# Altium schematic sheet Adafruit STEMMA Speaker.SchDoc: Adafruit STEMMA Speaker
size 282 x 211 mm; Origin: Eagle; SheetNumber: 1; COMPANY: COMPANY; DRAWN: DRAWN; Date: 2019/10/3 15:38:12; REV: REV; GateName_1: G$1; SymbolName_1: FRAME_A4; LibraryName: microbuilder; DeviceSetName: FRAME_A4; GateName_2: G$3; SymbolName_2: FRAME_DOCFIELD; DRG: DRG; o: o; N: N; YEAR: >YEAR; C: C; ISSUE: ISSUE; FILE: FILE:; PAGE: PAGE:; CHECKED: CHECKED; DRGNO: >DRGNO
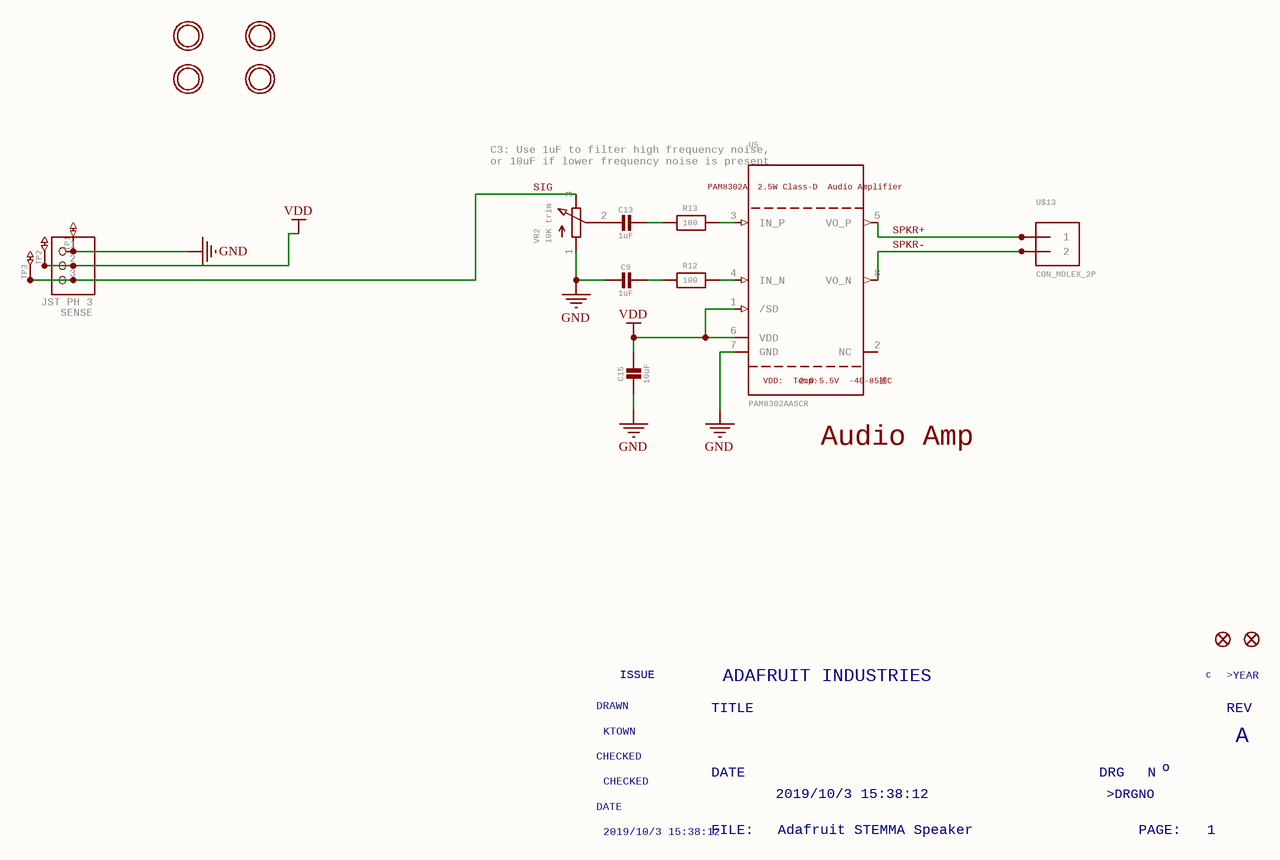
[diagram p0: Adafruit STEMMA Speaker.SchDoc]

## Parts
C9  1uF  [0603-NO]
C13  1uF  [0603-NO]
C15  10uF  [0805-NO]
FID1  FIDUCIAL_1MM  [FIDUCIAL_1MM]  (value not drawn)
FID2  FIDUCIAL_1MM  [FIDUCIAL_1MM]  (value not drawn)
R12  100  [0603-NO]
R13  100  [0603-NO]
SENSE  JST PH 3  [JSTPH3]
TP1  SEWTAPPCB_ALLIGATOR  [PCB_ALLI]  (value not drawn)
TP2  SEWTAPPCB_ALLIGATOR  [PCB_ALLI]  (value not drawn)
TP3  SEWTAPPCB_ALLIGATOR  [PCB_ALLI]  (value not drawn)
U5  PAM8302AASCR  PAM8302A
2.5WClass-D
AudioAmplifier: PAM8302A / 2.5W Class-D / Audio Amplifier  VDD:
Temp: VDD: / Temp:  2.0-5.5V
-40-85掳C: 2.0-5.5V / -40-85掳C  [MSOP8_0.65MM]
U$9  MOUNTINGHOLE2.0  [MOUNTINGHOLE_2.0_PLATED]  (value not drawn)
U$10  MOUNTINGHOLE2.0  [MOUNTINGHOLE_2.0_PLATED]  (value not drawn)
U$11  MOUNTINGHOLE2.0  [MOUNTINGHOLE_2.0_PLATED]  (value not drawn)
U$12  MOUNTINGHOLE2.0  [MOUNTINGHOLE_2.0_PLATED]  (value not drawn)
U$13  CON_MOLEX_2P  [53398-0271]
VR2  10K trim  [TRIMPOT_BOURNS_3303W]

## Nets
GND: C9.2 C15.2 SENSE.1 TP1.P$1(SEW) U5.7(GND) VR2.1(A)
VDD: C15.1 SENSE.2 TP2.P$1(SEW) U5.1(/SD) U5.6(VDD)
SIG: SENSE.3 TP3.P$1(SEW) VR2.3(E)
SPKR+: U5.5(VO_P) U$13.1
SPKR-: U5.8(VO_N) U$13.2
NetC9_1: C9.1 R12.1
NetC13_1: C13.1 R13.1
NetC13_2: C13.2 VR2.2(S)
NetR12_2: R12.2 U5.4(IN_N)
NetR13_2: R13.2 U5.3(IN_P)

Not connected (* = marked no-connect by the designer): U5 2(NC)

## Notes on the sheet
- C3: Use 1uF to filter high frequency noise,
  or 10uF if lower frequency noise is present
- Audio Amp
- DRAWN
- KTOWN
- ISSUE
- TITLE
- ADAFRUIT INDUSTRIES
- C
- REV
- >YEAR
- CHECKED
- DATE
- 2019/10/3 15:38:12
- DRG
- >DRGNO
- N
- o
- A
- FILE:
- Adafruit STEMMA Speaker
- PAGE:
- 1

## Library data of the parts
C9 C13 = CAP_CERAMIC0603_NO: Ceramic Capacitors   For new designs, use the packages preceded by an '_' character since they are more reliable:   The following footprints should be used on most boards: _0402 - Standard footprint for regular board layouts  _0603 - Standard footprint for regular board layouts  _0805 - Standard footprint for regular board layouts  _1206 - Standard footprint for regular board layouts       For extremely tight-pitch boards where space is at a premium, the following 'micro-pitch' footprints can be used (smaller pads, no silkscreen outline, etc.): _0402MP - Micro-pitch footprint for very dense/compact boards  _0603MP - Micro-pitch footprint for very dense/compact boards  _0805MP - Micro-pitch footprint for very dense/compact boards  _1206MP - Micro-pitch footprint for very dense/compact boards; GateName_1: G$1; SymbolName_1: CAPACITOR; DeviceName: 0603_NO; LibraryName: microbuilder; DeviceSetName: CAP_CERAMIC
C15 = CAP_CERAMIC0805-NOOUTLINE: Ceramic Capacitors   For new designs, use the packages preceded by an '_' character since they are more reliable:   The following footprints should be used on most boards: _0402 - Standard footprint for regular board layouts  _0603 - Standard footprint for regular board layouts  _0805 - Standard footprint for regular board layouts  _1206 - Standard footprint for regular board layouts       For extremely tight-pitch boards where space is at a premium, the following 'micro-pitch' footprints can be used (smaller pads, no silkscreen outline, etc.): _0402MP - Micro-pitch footprint for very dense/compact boards  _0603MP - Micro-pitch footprint for very dense/compact boards  _0805MP - Micro-pitch footprint for very dense/compact boards  _1206MP - Micro-pitch footprint for very dense/compact boards; GateName_1: G$1; SymbolName_1: CAPACITOR; DeviceName: 0805-NOOUTLINE; LibraryName: microbuilder; DeviceSetName: CAP_CERAMIC
FID1 FID2 = FIDUCIAL_1MM: Fiducial Alignment Points   Various fiducial points for machine vision alignment.; GateName_1: G$1; DeviceName: _1MM; BOM: EXCLUDE; SymbolName_1: FIDUCIAL; LibraryName: microbuilder; DeviceSetName: FIDUCIAL
R12 R13 = RESISTOR_0603_NOOUT: Resistors   For new designs, use the packages preceded by an '_' character since they are more reliable:   The following footprints should be used on most boards: _0402 - Standard footprint for regular board layouts  _0603 - Standard footprint for regular board layouts  _0805 - Standard footprint for regular board layouts  _1206 - Standard footprint for regular board layouts       For extremely tight-pitch boards where space is at a premium, the following 'micro-pitch' footprints can be used (smaller pads, no silkscreen outline, etc.): _0402MP - Micro-pitch footprint for very dense/compact boards  _0603MP - Micro-pitch footprint for very dense/compact boards  _0805MP - Micro-pitch footprint for very dense/compact boards  _1206MP - Micro-pitch footprint for very dense/compact boards; GateName_1: G$1; SymbolName_1: RESISTOR; DeviceName: _0603_NOOUT; LibraryName: microbuilder; DeviceSetName: RESISTOR
SENSE = CON_JST_PH_3PIN: GateName_1: G$1; SymbolName_1: PINHD3; LibraryName: microbuilder; DeviceSetName: CON_JST_PH_3PIN
TP1-TP3 = SEWTAPPCB_ALLIGATOR: GateName_1: G$1; SymbolName_1: SEWTAP; DeviceName: PCB_ALLIGATOR; LibraryName: microbuilder; DeviceSetName: SEWTAP
U5 = AUDIOAMP_PAM8302A: PAM8302A - 2.5W Class-D Mono Audio Amplifier    MSOP8 = PAM8302AASCR; GateName_1: G$1; SymbolName_1: PAM8302A; LibraryName: microbuilder; DeviceSetName: AUDIOAMP_PAM8302A
U$9-U$12 = MOUNTINGHOLE2.0: Mounting Hole   For #2 screws (0.086"/2.18mm width, 0.094"/2.4mm hole) use 2.5mm; GateName_1: G$1; DeviceName: 2.0; BOM: EXCLUDE; SymbolName_1: MOUNTINGHOLE; LibraryName: microbuilder; DeviceSetName: MOUNTINGHOLE
U$13 = CON_MOLEX_2P: GateName_1: G$1; SymbolName_1: 1X2; LibraryName: microbuilder; DeviceSetName: CON_MOLEX_2P
VR2 = TRIMPOT3303W/X: 3-Pin SMT Trimpots   Bourns TC33 (X-2) Series  1K - Digikey: TC33X-102ECT-ND   10K - Digikey: TC33X-2-103E   100K - Digikey: TC33X-104ECT-ND       Bourns 3303 (W) Series  3mm 10K Single Turn - Digikey: 3303W-103ETR-ND   3mm 100K Single Turn - Digikey: 3303X-104ETR-ND; GateName_1: G$1; SymbolName_1: POTENTIOMETER; DeviceName: 3303W/X; LibraryName: microbuilder; DeviceSetName: TRIMPOT